# EAGLE schematic ECE411_Project1 (EAGLE 9.1.3)
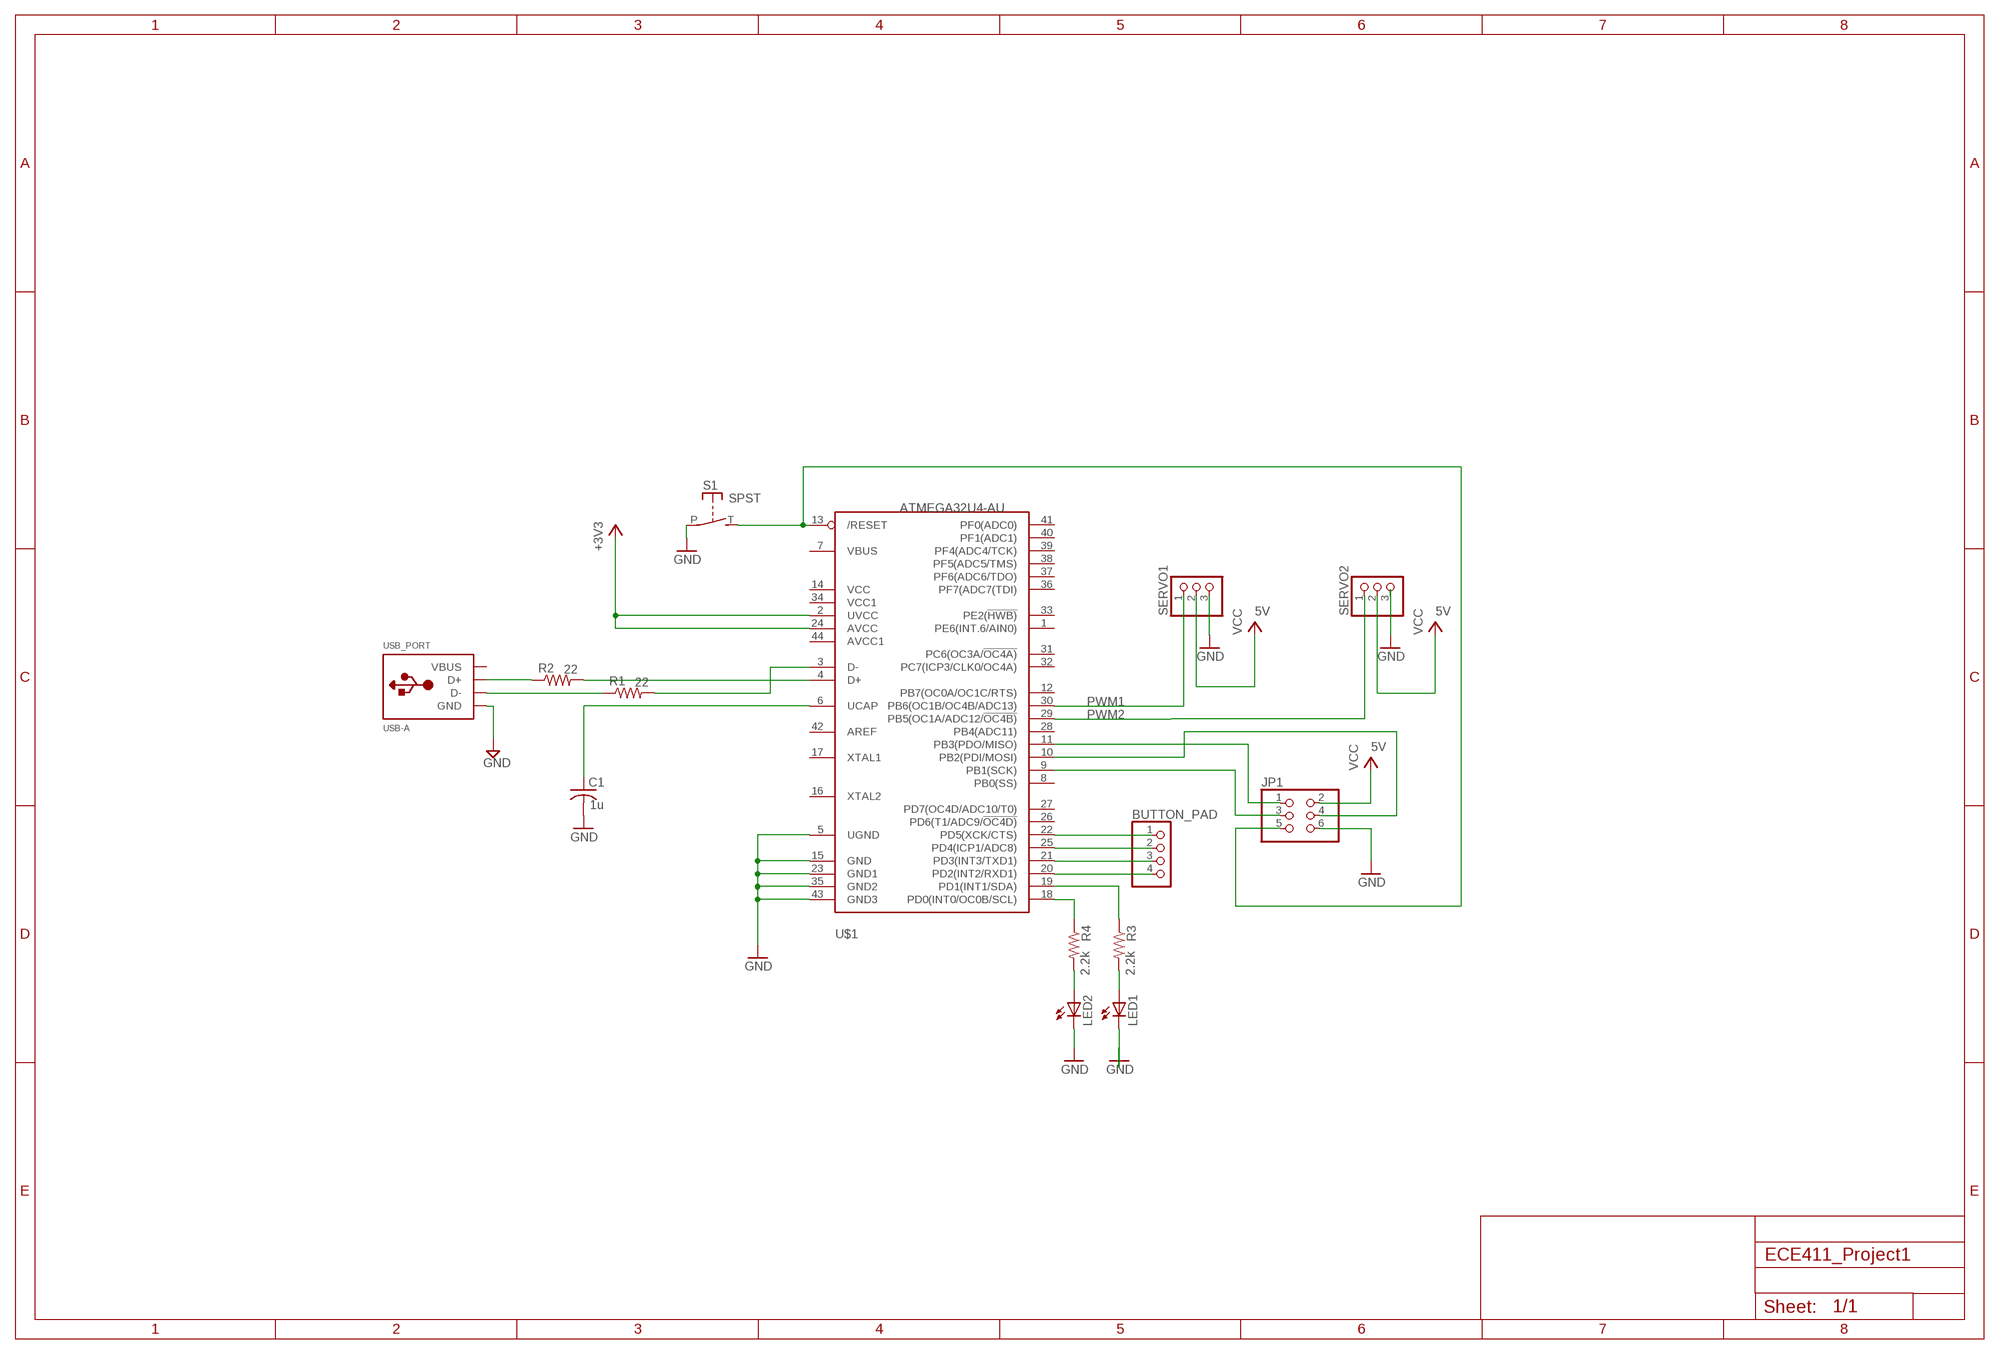
[diagram p0: schematic, sheet 1]

## Parts
BUTTON_PAD  PINHD-1X4  [1X04]
C1  C-US025-024X044  [C025-024X044]
JP1  PINHD-2X3  [2X03]
LED1  LED  [SMARTLED-TTW]
LED2  LED  [SMARTLED-TTW]
R1  R-US_0204/7  [0204/7]
R2  R-US_0204/7  [0204/7]
R3  R-US_0204/2V  [0204V]
R4  R-US_0204/2V  [0204V]
S1  SPST  [JUDCOSPST]
SERVO1  PINHD-1X3  [1X03]
SERVO2  PINHD-1X3  [1X03]
U$1  ATMEGA32U4-AU  [TQFP44]
USB_PORT  USB-A  [MOLEX_480371000]

## Nets
+3V3: U$1.2(UVCC) U$1.24(AVCC)
GND: C1.2 JP1.6 LED1.C@1(C) LED2.C@1(C) S1.P SERVO1.3 SERVO2.3 U$1.5(UGND) U$1.15(GND) U$1.23(GND1) U$1.35(GND2) U$1.43(GND3) USB_PORT.4(GND)
N$1: R2.1 USB_PORT.3(D+)
N$2: R2.2 U$1.4(D+)
N$3: R1.1 USB_PORT.2(D-)
N$4: R1.2 U$1.3(D-)
N$5: C1.1 U$1.6(UCAP)
N$6: R4.1 U$1.18(PD0(INT0/OC0B/SCL))
N$7: BUTTON_PAD.4 U$1.20(PD2(INT2/RXD1))
N$8: R3.1 U$1.19(PD1(INT1/SDA))
N$9: LED2.A@1(A) R4.2
N$10: LED1.A@1(A) R3.2
N$11: BUTTON_PAD.3 U$1.21(PD3(INT3/TXD1))
N$12: BUTTON_PAD.2 U$1.25(PD4(ICP1/ADC8))
N$13: BUTTON_PAD.1 U$1.22(PD5(XCK/CTS))
N$14: JP1.5 S1.T(S) U$1.13(/RESET)
N$15: JP1.2
N$16: JP1.1 U$1.11(PB3(PDO/MISO))
N$17: JP1.4 U$1.10(PB2(PDI/MOSI))
N$18: JP1.3 U$1.9(PB1(SCK))
PWM1: SERVO1.1 U$1.30(PB6(OC1B/OC4B/ADC13))
PWM2: SERVO2.1 U$1.29(PB5(OC1A/ADC12/!OC4B))
VCC: SERVO1.2 SERVO2.2
Unconnected: U$1.1(PE6(INT.6/AIN0)) U$1.7(VBUS) U$1.8(PB0(SS)) U$1.12(PB7(OC0A/OC1C/RTS)) U$1.14(VCC) U$1.16(XTAL2) U$1.17(XTAL1) U$1.26(PD6(T1/ADC9/!OC4D)) U$1.27(PD7(OC4D/ADC10/T0)) U$1.28(PB4(ADC11)) U$1.31(PC6(OC3A/!OC4A)) U$1.32(PC7(ICP3/CLK0/OC4A)) U$1.33(PE2(!HWB)) U$1.34(VCC1) U$1.36(PF7(ADC7(TDI)) U$1.37(PF6(ADC6/TDO)) U$1.38(PF5(ADC5/TMS)) U$1.39(PF4(ADC4/TCK)) U$1.40(PF1(ADC1)) U$1.41(PF0(ADC0)) U$1.42(AREF) U$1.44(AVCC1)

## Power pins joined to a net without a drawn wire
VBUS: USB_PORT.1(VBUS)

## Library data of the parts
BUTTON_PAD = pinhead:PINHD-1X4: PIN HEADER
C1 = rcl:C-US: CAPACITOR, American symbol; SPICEPREFIX: 1u
JP1 = pinhead:PINHD-2X3: PIN HEADER
LED1 LED2 = adafruit:LED: LED OSRAM: - CHIPLED LG R971, LG N971, LY N971, LG Q971, LY Q971, LO R971, LY R971 LH N974, LH R974 LS Q976, LO Q976, LY Q976 LO Q996 - Hyper CHIPLED LW Q18S LB Q993, LB Q99A, LB R99A - SideLED LS A670, LO A670, LY A670, LG A670, LP A670 LB A673, LV A673, LT A673, LW A673 LH A674 LY A675 LS A676, LA A676, LO A676, LY A676, LW A676 LS A679, LY A679, LG A679 - Hyper Micro SIDELED® LS Y876, LA Y876, LO Y876, LY Y876 LT Y87S - SmartLED LW L88C, LW L88S LB L89C, LB L89S, LG L890 LS L89K, LO L89K, LY L89K LS L896, LA L896, LO L896, LY L896 - TOPLED LS T670, LO T670, LY T670, LG T670, LP T670 LSG T670, LSP T670, LSY T670, LOP T670, LYG T670 LG T671, LOG T671, LSG T671 LB T673, LV T673, LT T673, LW T673 LH T674 LS T676, LA T676, LO T676, LY T676, LB T676, LH T676, LSB T676, LW T676 LB T67C, LV T67C, LT T67C, LS T67K, LO T67K, LY T67K, LW E67C LS E67B, LA E67B, LO E67B, LY E67B, LB E67C, LV E67C, LT E67C LW T67C LS T679, LY T679, LG T679 LS T770, LO T770, LY T770, LG T770, LP T770 LB T773, LV T773, LT T773, LW T773 LH T774 LS E675, LA E675, LY E675, LS T675 LS T776, LA T776, LO T776, LY T776, LB T776 LHGB T686 LT T68C, LB T68C - Hyper Mini TOPLED® LB M676 - Mini TOPLED Santana® LG M470 LS M47K, LO M47K, LY M47K Source: http://www.osram.convergy.de/
R1 R2 = rcl:R-US_: RESISTOR, American symbol; SPICEPREFIX: 22
R3 R4 = rcl:R-US_: RESISTOR, American symbol; SPICEPREFIX: 2.2k
S1 = adafruit:SPST: Judco 50-0015-00
SERVO1 SERVO2 = pinhead:PINHD-1X3: PIN HEADER
U$1 = adafruit:ATMEGA32U4: http://www.ladyada.net/library/eagle
USB_PORT = adafruit:USB-A: USB type A 'plug' Used for things that can directly connect to a USB port, say USB key; SPICEPREFIX: X